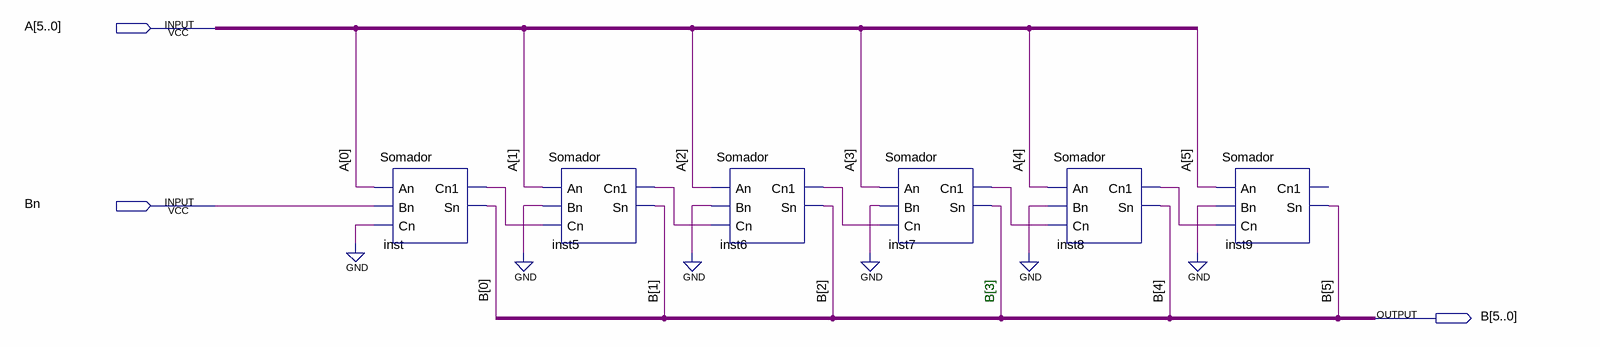
[diagram p0: schematic sheet]
// Quartus schematic SomadorCompleto6x1.bdf as structural Verilog: 6 symbols, 3 pins
module SomadorCompleto6x1 (
  input  [5:0] A,
  input  Bn,
  output [5:0] B
);

  wire inst5_cn1, inst6_cn1, inst7_cn1, inst8_cn1, inst_cn1;

  Somador inst (.An(A[0]), .Bn(Bn), .Cn(1'b0), .Cn1(inst_cn1), .Sn(B[0]));
  Somador inst5 (.An(A[1]), .Bn(1'b0), .Cn(inst_cn1), .Cn1(inst5_cn1), .Sn(B[1]));
  Somador inst6 (.An(A[2]), .Bn(1'b0), .Cn(inst5_cn1), .Cn1(inst6_cn1), .Sn(B[2]));
  Somador inst7 (.An(A[3]), .Bn(1'b0), .Cn(inst6_cn1), .Cn1(inst7_cn1), .Sn(B[3]));
  Somador inst8 (.An(A[4]), .Bn(1'b0), .Cn(inst7_cn1), .Cn1(inst8_cn1), .Sn(B[4]));
  Somador inst9 (.An(A[5]), .Bn(1'b0), .Cn(inst8_cn1), .Sn(B[5]));  // open: Cn1

  // Notes on the sheet:
  //   B[3]
endmodule
